# Altium schematic sheet LARIX_V5_1.SchDoc
size 409 x 282 mm; >DRAWING_NAME: LARIX_V5.sch; >LAST_DATE_TIME: 05.02.2016 10:43:52; >SHEET: 2; Sheet:: Sheet:; Legal Disclaimer: Legal Disclaimer; The information given in this document shall in no event be regarded as a guarantee of conditions or: The information given in this document shall in no event be regarded as a guarantee of conditions or; characteristics. With respect to any examples or hints given herein, any typical values stated herein and/or any: characteristics. With respect to any examples or hints given herein, any typical values stated herein and/or any; information regarding the application of the device, Infineon Technologies hereby disclaims any and all warranties: information regarding the application of the device, Infineon Technologies hereby disclaims any and all warranties; and liabilities of any kind, including without limitation, warranties of non-infringement of intellectual property rights: and liabilities of any kind, including without limitation, warranties of non-infringement of intellectual property rights; of any third party.: of any third party.
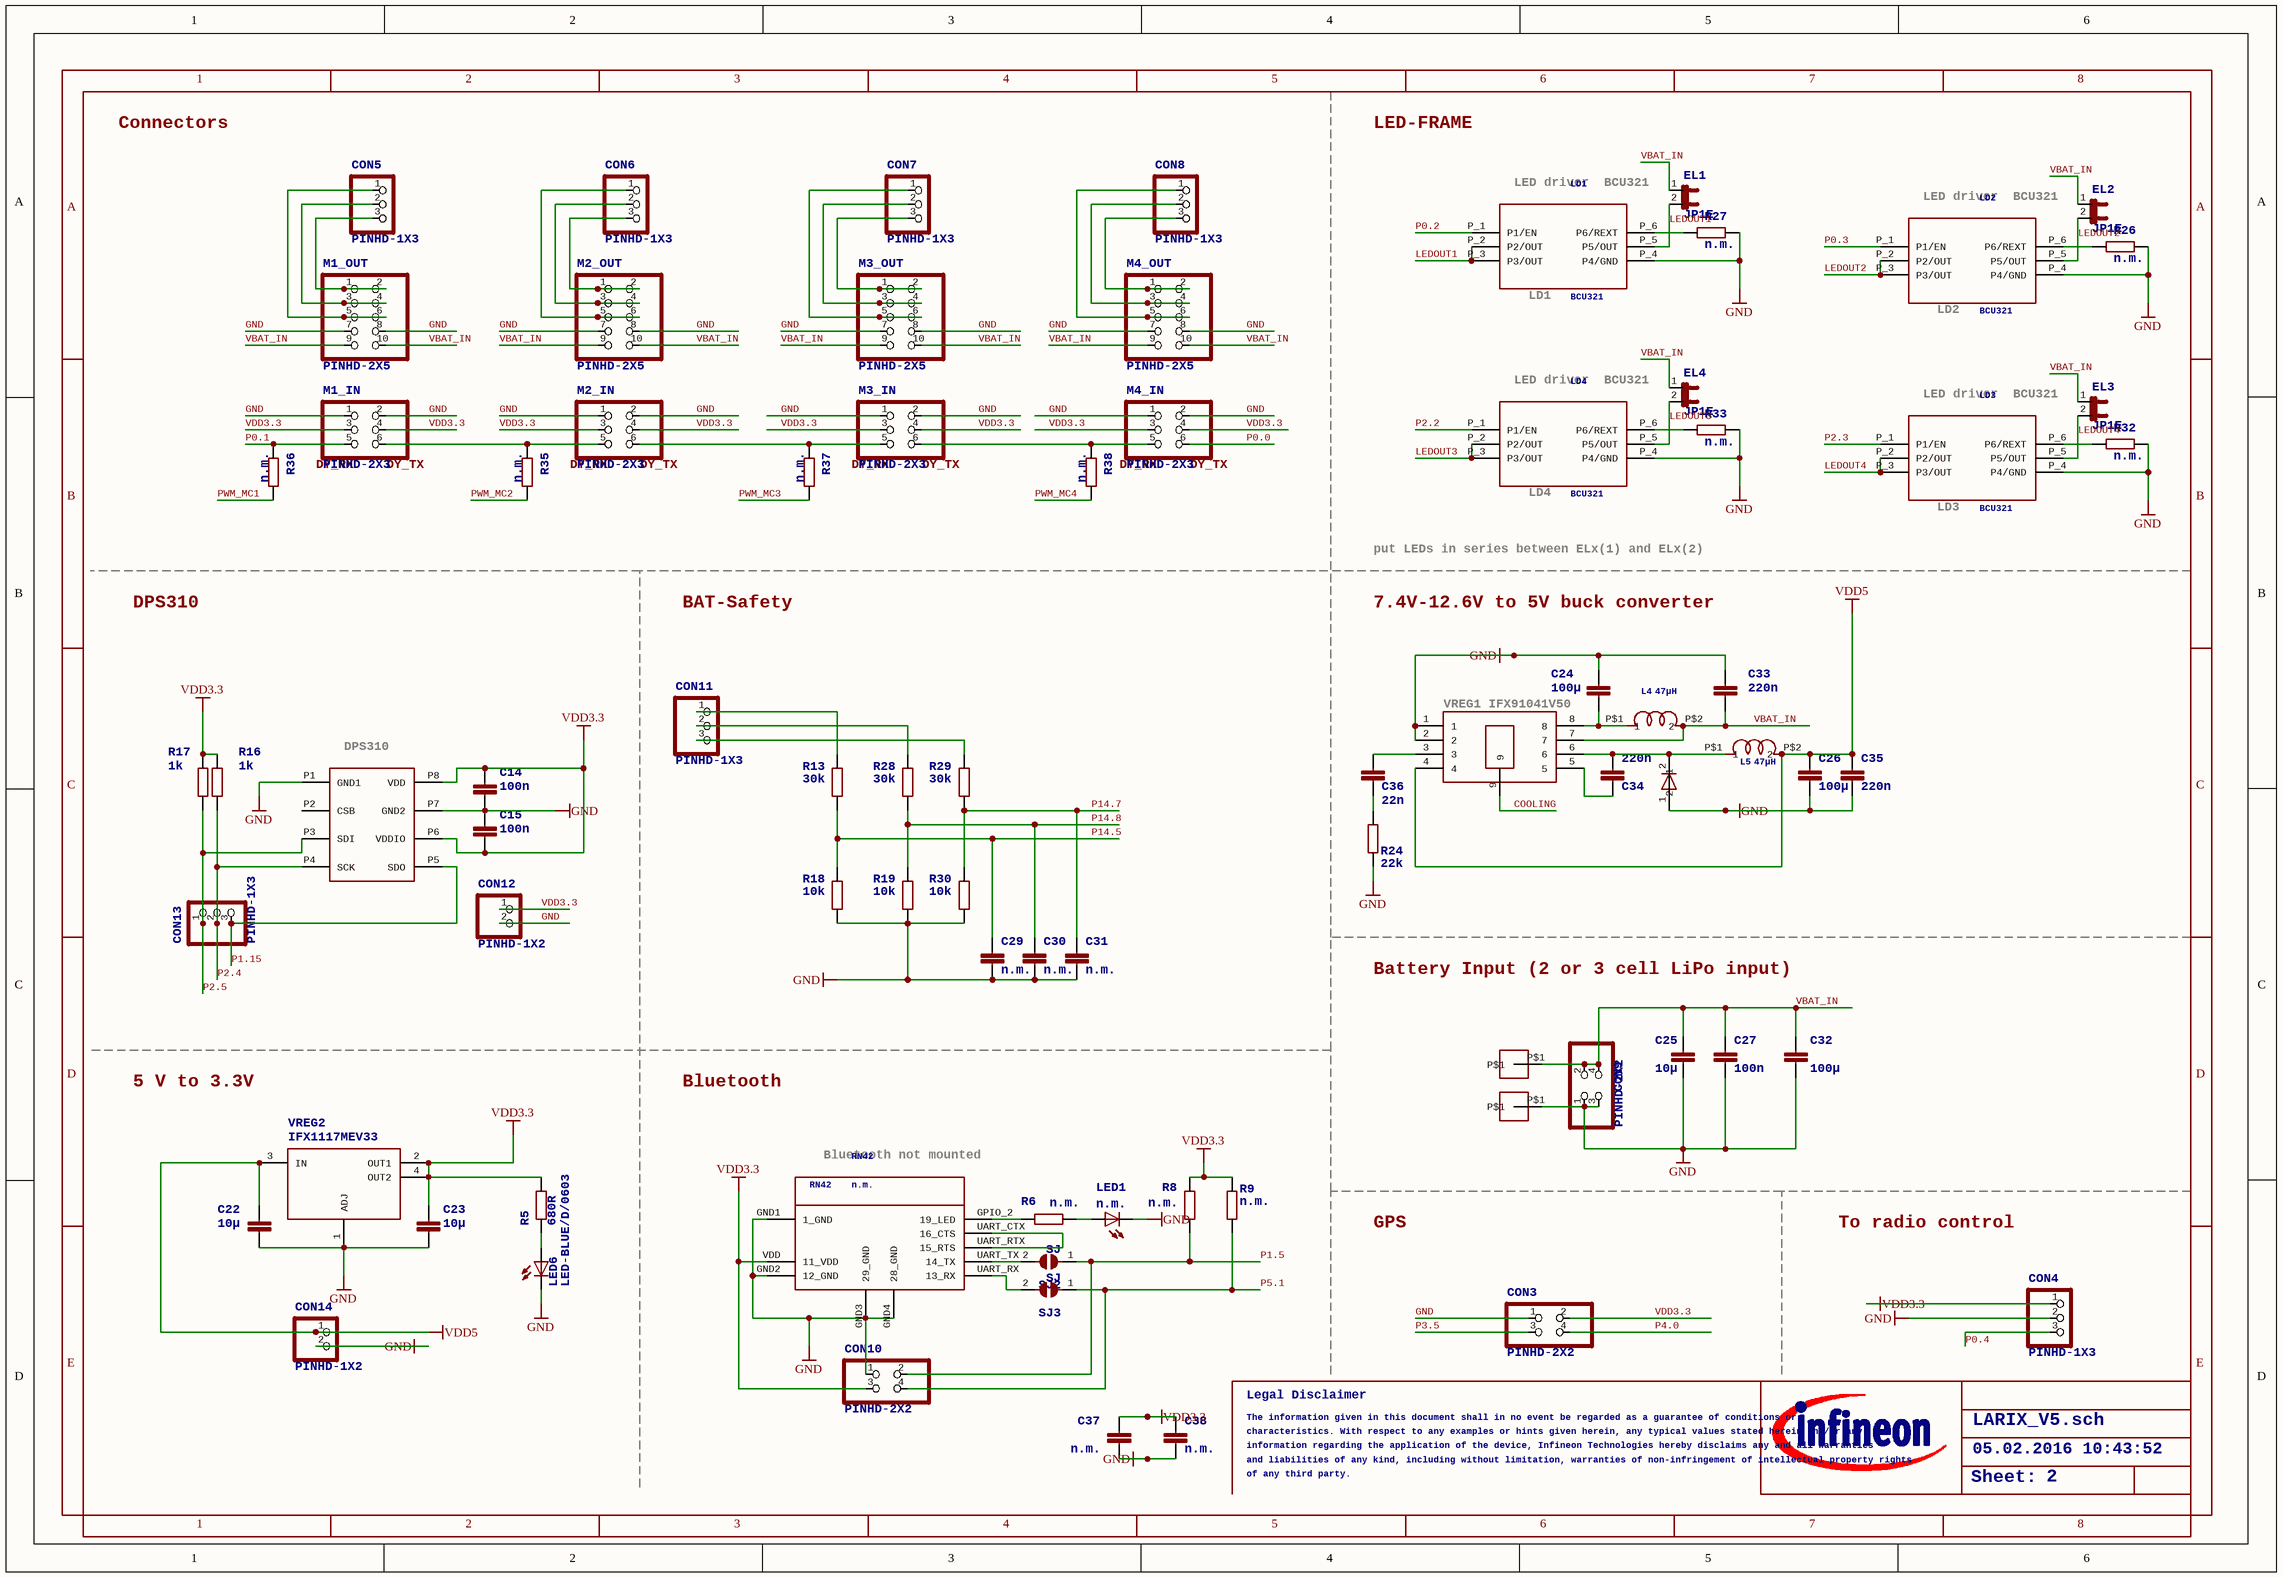
[diagram p0: LARIX_V5_1.SchDoc]

## Parts
C14  100n  [C0603]
C15  100n  [C0603]
C22  10µ  [C0805K]
C23  10µ  [C0805K]
C24  100µ  [C1210]
C25  10µ  [C0805K]
C26  >NAME: C26  [C1210]  (hidden comment: 100µ)
C27  100n  [C0603]
C29  n.m.  [C0603]
C30  n.m.  [C0603]
C31  n.m.  [C0603]
C32  100µ  [C1210]
C33  220n  [C0603]
C34  220n  [C0603]
C35  220n  [C0603]
C36  22n  [C0603]
C37  n.m.  [C0805K]
C38  n.m.  [C0603]
CON3  >NAME: CON3  [2X02]  (hidden comment: PINHD-2X2)
CON4  >NAME: CON4  [1X03]  (hidden comment: PINHD-1X3)
CON5  >NAME: CON5  [1X03]  (hidden comment: PINHD-1X3)
CON6  >NAME: CON6  [1X03]  (hidden comment: PINHD-1X3)
CON7  >NAME: CON7  [1X03]  (hidden comment: PINHD-1X3)
CON8  >NAME: CON8  [1X03]  (hidden comment: PINHD-1X3)
CON9  PINHD-2X2  [2X02]
CON10  >NAME: CON10  [2X02]  (hidden comment: PINHD-2X2)
CON11  >NAME: CON11  [1X03]  (hidden comment: PINHD-1X3)
CON12  >NAME: CON12  [1X02]  (hidden comment: PINHD-1X2)
CON13  >NAME: CON13  [1X03]  (hidden comment: PINHD-1X3)
CON14  >NAME: CON14  [1X02]  (hidden comment: PINHD-1X2)
D6  BAS21-03W  [INF-SOD323_V_1PRIMARY]  (value not drawn)
DPS310  Infineon  [LGA8R125P0X4_500X300X120]  (value not drawn)
EL1  >NAME: EL1  [JP1]  (hidden comment: JP1E)
EL2  >NAME: EL2  [JP1]  (hidden comment: JP1E)
EL3  >NAME: EL3  [JP1]  (hidden comment: JP1E)
EL4  >NAME: EL4  [JP1]  (hidden comment: JP1E)
L4  47µH  [WE-TPC]
L5  47µH  [WE-TPC]
LD1  >NAME: LD1  [SC74]  (hidden comment: BCU321)
LD2  >NAME: LD2  [SC74]  (hidden comment: BCU321)
LD3  >NAME: LD3  [SC74]  (hidden comment: BCU321)
LD4  >NAME: LD4  [SC74]  (hidden comment: BCU321)
LED1  n.m.  [CHIPLED_0603]
LED6  >NAME: LED6  [CHIPLED_0603]  (hidden comment: LED-BLUE/D/0603)
M1_IN  >NAME: M1_IN  [2X03]  (hidden comment: PINHD-2X3)
M1_OUT  >NAME: M1_OUT  [2X05]  (hidden comment: PINHD-2X5)
M2_IN  >NAME: M2_IN  [2X03]  (hidden comment: PINHD-2X3)
M2_OUT  >NAME: M2_OUT  [2X05]  (hidden comment: PINHD-2X5)
M3_IN  >NAME: M3_IN  [2X03]  (hidden comment: PINHD-2X3)
M3_OUT  >NAME: M3_OUT  [2X05]  (hidden comment: PINHD-2X5)
M4_IN  >NAME: M4_IN  [2X03]  (hidden comment: PINHD-2X3)
M4_OUT  >NAME: M4_OUT  [2X05]  (hidden comment: PINHD-2X5)
PAD1  PAD-BATTERY  [BATT-SOLDER]  (value not drawn)
PAD2  PAD-BATTERY  [BATT-SOLDER]  (value not drawn)
R5  >NAME: R5  [R0603]  (hidden comment: 680R)
R6  n.m.  [R0603]
R8  n.m.  [R0603]
R9  n.m.  [R0603]
R13  30k  [R0603]
R16  1k  [R0603]
R17  1k  [R0603]
R18  10k  [R0603]
R19  10k  [R0603]
R24  22k  [R0603]
R26  n.m.  [R0603]
R27  n.m.  [R0603]
R28  30k  [R0603]
R29  30k  [R0603]
R30  10k  [R0603]
R32  n.m.  [R0603]
R33  n.m.  [R0603]
R35  >NAME: R35  [R0603]  (hidden comment: n.m.)
R36  >NAME: R36  [R0603]  (hidden comment: n.m.)
R37  >NAME: R37  [R0603]  (hidden comment: n.m.)
R38  >NAME: R38  [R0603]  (hidden comment: n.m.)
RN42  >NAME: RN42  [RN42+SHIELD]  (hidden comment: n.m.)
SJ2  >NAME: SJ2  [SJ]  (hidden comment: SJ)
SJ3  >NAME: SJ3  [SJ]  (hidden comment: SJ)
VREG1  IFX91041V50  [INF-PG-DSO-8-27_N_1PRIMARY]  (value not drawn)
VREG2  >NAME: VREG2  [SOT223]  (hidden comment: IFX1117MEV33)

## Nets
GND: C14.2 C15.1 C22.2 C23.2 C24.1 C25.2 C26.2 C27.2 C29.2 C30.2 C31.2 C32.2 C33.1 C35.2 C37.2 C38.2 CON3.1 CON4.2 CON9.1 CON9.3 CON10.1 CON12.2 CON14.2 D6.1 DPS310.P1(GND1) DPS310.P7(GND2) LD1.P_4(P4/GND) LD2.P_4(P4/GND) LD3.P_4(P4/GND) LD4.P_4(P4/GND) LED1.C LED6.C M1_IN.1 M1_IN.2 M1_OUT.7 M1_OUT.8 M2_IN.1 M2_IN.2 M2_OUT.7 M2_OUT.8 M3_IN.1 M3_IN.2 M3_OUT.7 M3_OUT.8 M4_IN.1 M4_IN.2 M4_OUT.7 M4_OUT.8 PAD2.P$1 R18.2 R19.2 R24.2 R26.2 R27.2 R30.2 R32.2 R33.2 RN42.GND1(1_GND) RN42.GND2(12_GND) RN42.GND3(29_GND) RN42.GND4(28_GND) VREG1.1 VREG1.2 VREG2.1(ADJ)
VDD3.3: C14.1 C15.2 C23.1 C37.1 C38.1 CON3.2 CON4.1 CON10.3 CON12.1 DPS310.P6(VDDIO) DPS310.P8(VDD) M1_IN.3 M1_IN.4 M2_IN.3 M2_IN.4 M3_IN.3 M3_IN.4 M4_IN.3 M4_IN.4 R5.2 R8.1 R9.1 R16.1 R17.1 RN42.VDD(11_VDD) VREG2.2(OUT1) VREG2.4(OUT2)
VDD5: C22.1 C26.1 C35.1 CON14.1 L5.P$2(2) VREG1.4 VREG2.3(IN)
COOLING: VREG1.9
LEDOUT1: EL1.2 LD1.P_2(P2/OUT) LD1.P_3(P3/OUT) LD1.P_5(P5/OUT)
LEDOUT2: EL2.2 LD2.P_2(P2/OUT) LD2.P_3(P3/OUT) LD2.P_5(P5/OUT)
LEDOUT3: EL4.2 LD4.P_2(P2/OUT) LD4.P_3(P3/OUT) LD4.P_5(P5/OUT)
LEDOUT4: EL3.2 LD3.P_2(P2/OUT) LD3.P_3(P3/OUT) LD3.P_5(P5/OUT)
P0.0: M4_IN.6
P0.1: M1_IN.5 R36.1
P0.2: LD1.P_1(P1/EN)
P0.3: LD2.P_1(P1/EN)
P0.4: CON4.3
P1.5: CON10.2 R8.2 SJ2.1
P1.15: CON13.3 DPS310.P5(SDO)
P2.2: LD4.P_1(P1/EN)
P2.3: LD3.P_1(P1/EN)
P2.4: CON13.2 DPS310.P4(SCK) R16.2
P2.5: CON13.1 DPS310.P3(SDI) R17.2
P3.5: CON3.3
P4.0: CON3.4
P5.1: CON10.4 R9.2 SJ3.1
P14.5: C29.1 R13.2 R18.1
P14.7: C31.1 R29.2 R30.1
P14.8: C30.1 R19.1 R28.2
PWM_MC1: R36.2
PWM_MC2: R35.2
PWM_MC3: R37.2
PWM_MC4: R38.2
VBAT_IN: C25.1 C27.1 C32.1 C33.2 CON9.2 CON9.4 EL1.1 EL2.1 EL3.1 EL4.1 L4.P$2(2) M1_OUT.9 M1_OUT.10 M2_OUT.9 M2_OUT.10 M3_OUT.9 M3_OUT.10 M4_OUT.9 M4_OUT.10 PAD1.P$1 VREG1.7
NetC24_2: C24.2 L4.P$1(1) VREG1.8
NetC34_1: C34.1 D6.2 L5.P$1(1) VREG1.6
NetC34_2: C34.2 VREG1.5
NetC36_1: C36.1 VREG1.3
NetC36_2: C36.2 R24.1
NetCON5_1: CON5.1 M1_OUT.5 M1_OUT.6
NetCON5_2: CON5.2 M1_OUT.3 M1_OUT.4
NetCON5_3: CON5.3 M1_OUT.1 M1_OUT.2
NetCON6_1: CON6.1 M2_OUT.5 M2_OUT.6
NetCON6_2: CON6.2 M2_OUT.3 M2_OUT.4
NetCON6_3: CON6.3 M2_OUT.1 M2_OUT.2
NetCON7_1: CON7.1 M3_OUT.5 M3_OUT.6
NetCON7_2: CON7.2 M3_OUT.3 M3_OUT.4
NetCON7_3: CON7.3 M3_OUT.1 M3_OUT.2
NetCON8_1: CON8.1 M4_OUT.5 M4_OUT.6
NetCON8_2: CON8.2 M4_OUT.3 M4_OUT.4
NetCON8_3: CON8.3 M4_OUT.1 M4_OUT.2
NetCON11_1: CON11.1 R13.1
NetCON11_2: CON11.2 R28.1
NetCON11_3: CON11.3 R29.1
NetLD1_P_6: LD1.P_6(P6/REXT) R27.1
NetLD2_P_6: LD2.P_6(P6/REXT) R26.1
NetLD3_P_6: LD3.P_6(P6/REXT) R32.1
NetLD4_P_6: LD4.P_6(P6/REXT) R33.1
NetLED1_A: LED1.A R6.1
NetLED6_A: LED6.A R5.1
NetM1_IN_6: M1_IN.6 M2_IN.5 R35.1
NetM2_IN_6: M2_IN.6 M3_IN.5 R37.1
NetM3_IN_6: M3_IN.6 M4_IN.5 R38.1
NetR6_2: R6.2 RN42.GPIO_2(19_LED)
NetRN42_UART_CTX: RN42.UART_CTX(16_CTS) RN42.UART_RTX(15_RTS)
NetRN42_UART_RX: RN42.UART_RX(13_RX) SJ3.2
NetRN42_UART_TX: RN42.UART_TX(14_TX) SJ2.2

Not connected (* = marked no-connect by the designer): DPS310 P2(CSB)

## Notes on the sheet
- Connectors
- LED-FRAME
- LED driver
  BCU321
- (near LD1) LD1
- (near LD2) LD2
- (near M1_IN) DY_RX
- (near M1_IN) DY_TX
- (near M2_IN) DY_RX
- (near M2_IN) DY_TX
- (near M3_IN) DY_RX
- (near M3_IN) DY_TX
- DY_RX
- (near M4_IN) DY_TX
- (near LD4) LD4
- (near LD3) LD3
- DPS310
- BAT-Safety
- 7.4V-12.6V to 5V buck converter
- put LEDs in series between
  ELx(1) and ELx(2)
- (near DPS310) DPS310
- (near VREG1) VREG1
  IFX91041V50
- Battery Input (2 or 3 cell LiPo input)
- 5 V to 3.3V
- Bluetooth
- Bluetooth not mounted
- GPS
- To radio control
- 1
- 2
- 3
- 4
- 5
- 6
- 7
- 8
- A
- B
- C
- D
- E

## Library data of the parts
C14 C15 C27 C29-C31 C33-C36 C38 = C-EUC0603: <B>CAPACITOR</B>, European symbol
C22 C23 C25 C37 = C-EUC0805K: <B>CAPACITOR</B>, European symbol
C24 C26 C32 = C-EUC1210: <B>CAPACITOR</B>, European symbol
  C26: >VALUE: 100µ
CON3 CON9 CON10 = PINHD-2X2: <b>PIN HEADER</b>
  CON3 CON10: >VALUE: PINHD-2X2
CON4-CON8 CON11 CON13 = PINHD-1X3: <b>PIN HEADER</b>; >VALUE: PINHD-1X3
CON12 CON14 = PINHD-1X2: <b>PIN HEADER</b>; >VALUE: PINHD-1X2
D6 = INF-SOD323_V_1
DPS310 = DPS310DRUCKSENSOR
EL1-EL4 = JP1E: <b>JUMPER</b>; >VALUE: JP1E
L4 L5 = WUERTH47UHIND
LD1-LD4 = BCU320: >VALUE: BCU321
LED1 LED6 = LEDCHIPLED_0603: <b>LED</b><p> / <u>OSRAM</u>:<br> / - <u>CHIPLED</u><br> / LG R971, LG N971, LY N971, LG Q971, LY Q971, LO R971, LY R971 / LH N974, LH R974<br> / LS Q976, LO Q976, LY Q976<br> / LO Q996<br> / - <u>Hyper CHIPLED</u><br> / LW Q18S<br> / LB Q993, LB Q99A, LB R99A<br> / - <u>SideLED</u><br> / LS A670, LO A670, LY A670, LG A670, LP A670<br> / LB A673, LV A673, LT A673, LW A673<br> / LH A674<br> / LY A675<br> / LS A676, LA A676, LO A676, LY A676, LW A676<br> / LS A679, LY A679, LG A679<br> / -  <u>Hyper Micro SIDELED®</u><br> / LS Y876, LA Y876, LO Y876, LY Y876<br> / LT Y87S<br> / - <u>SmartLED</u><br> / LW L88C, LW L88S<br> / LB L89C, LB L89S, LG L890<br> / LS L89K, LO L89K, LY L89K<br> / LS L896, LA L896, LO L896, LY L896<br> / - <u>TOPLED</u><br> / LS T670, LO T670, LY T670, LG T670, LP T670<br> / LSG T670, LSP T670, LSY T670, LOP T670, LYG T670<br> / LG T671, LOG T671, LSG T671<br> / LB T673, LV T673, LT T673, LW T673<br> / LH T674<br> / LS T676, LA T676, LO T676, LY T676, LB T676, LH T676, LSB T676, LW T676<br> / LB T67C, LV T67C, LT T67C, LS T67K, LO T67K, LY T67K, LW E67C<br> / LS E67B, LA E67B, LO E67B, LY E67B, LB E67C, LV E67C, LT E67C<br> / LW T67C<br> / LS T679, LY T679, LG T679<br> / LS T770, LO T770, LY T770, LG T770, LP T770<br> / LB T773, LV T773, LT T773, LW T773<br> / LH T774<br> / LS E675, LA E675, LY E675, LS T675<br> / LS T776, LA T776, LO T776, LY T776, LB T776<br> / LHGB T686<br> / LT T68C, LB T68C<br> / - <u>Hyper Mini TOPLED®</u><br> / LB M676<br> / - <u>Mini TOPLED Santana®</u><br> / LG M470<br> / LS M47K, LO M47K, LY M47K<br> / <p> / Source: http://www.osram.convergy.de/
  LED6: >VALUE: LED-BLUE/D/0603
M1_IN M2_IN M3_IN M4_IN = PINHD-2X3: <b>PIN HEADER</b>; >VALUE: PINHD-2X3
M1_OUT M2_OUT M3_OUT M4_OUT = PINHD-2X5: <b>PIN HEADER</b>; >VALUE: PINHD-2X5
R5 R6 R8 R9 R13 R16-R19 R24 R28-R30 R37 = R-EU_R0603
  R5: >VALUE: 680R
  R37: >VALUE: n.m.
R26 R27 R32 R33 R35 R36 R38 = R-EU_R0603: <B>RESISTOR</B>, European symbol
  R35 R36 R38: >VALUE: n.m.
RN42 = BLUETOOTHRN42+SHIELD: RN42: RN42; >VALUE: n.m.
SJ2 SJ3 = SJ: SMD solder <b>JUMPER</b>; >VALUE: SJ
VREG1 = INF-PG-DSO-8-27_N_1
VREG2 = IFX1117: >VALUE: IFX1117MEV33